# EAGLE schematic rx (EAGLE 9.6.0)
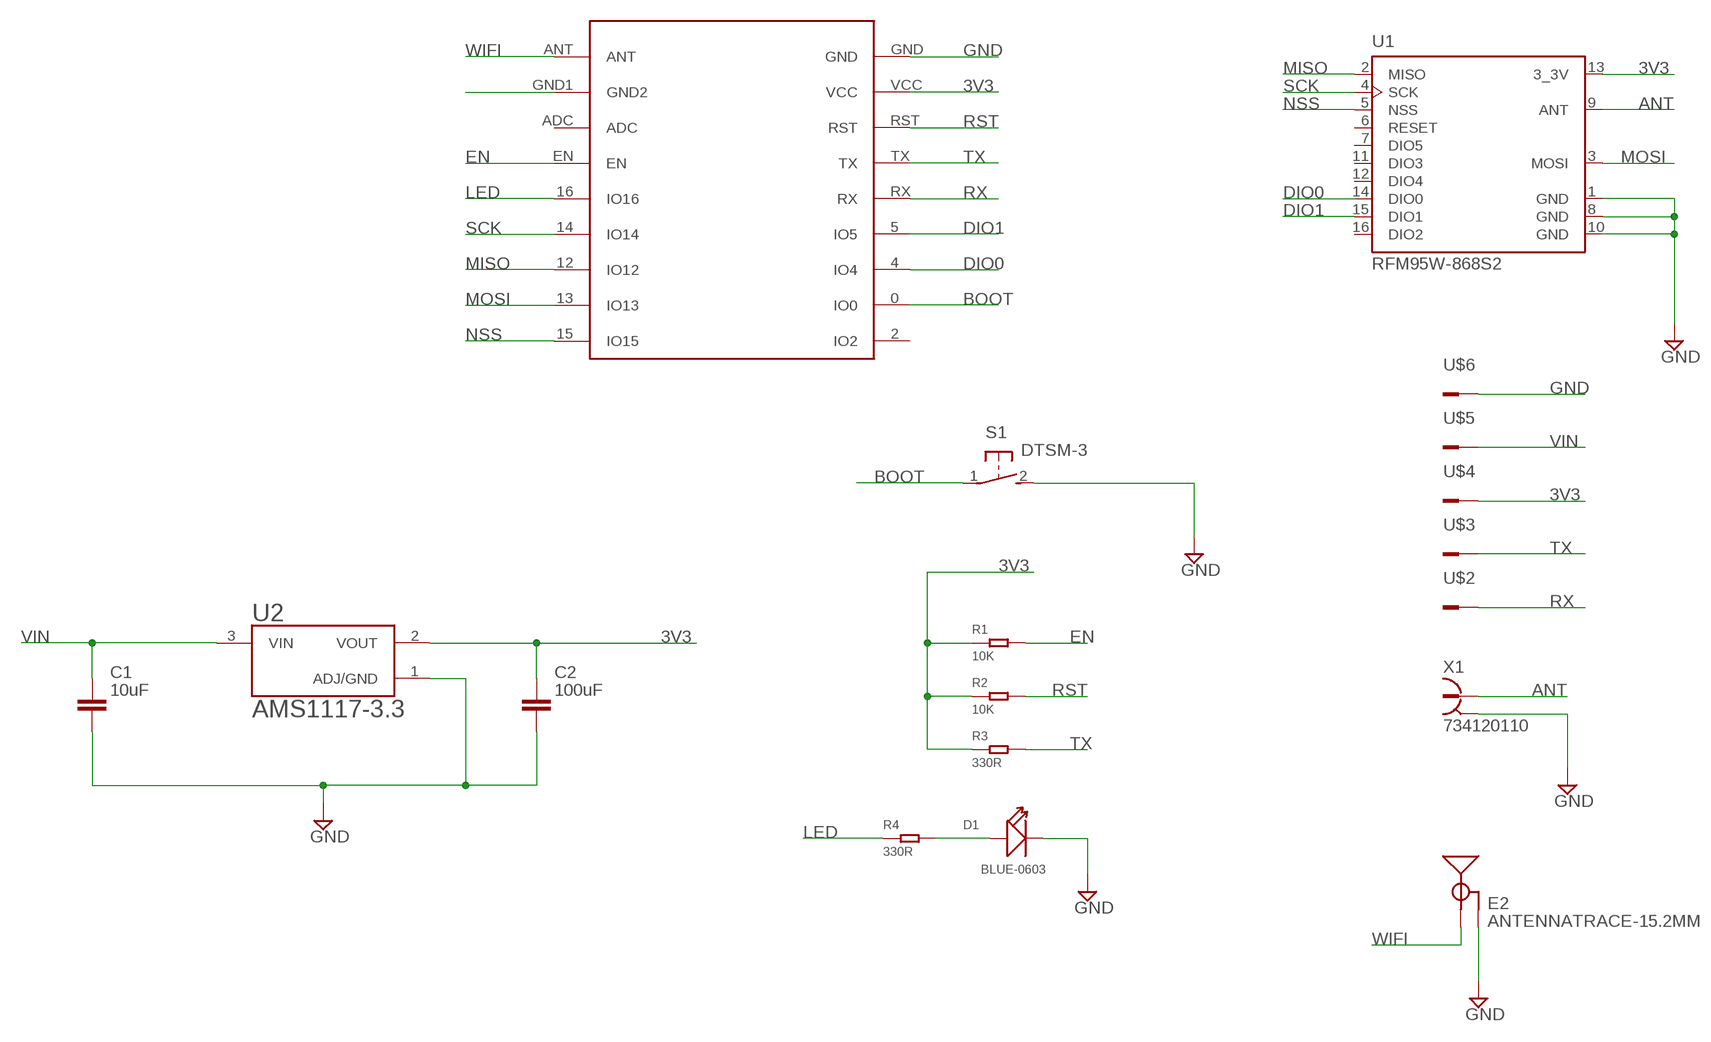
[diagram p0: schematic, sheet 1]

## Parts
C1  10uF  C_TANTALUM-1411(3528-METRIC)  [CAPM3528X210]
C2  100uF  C_TANTALUM-1411(3528-METRIC)  [CAPM3528X210]
D1  BLUE-0603  SMD-LED-CLEAR-BLUE(0603)  [LED-0603]
E2  ANTENNATRACE-15.2MM  [TRACE_ANTENNA_2.4GHZ_15.2MM]
R1  10K  SMD-RES-10K-1%-1/8W(0805)  [R0805]
R2  10K  SMD-RES-10K-1%-1/8W(0805)  [R0805]
R3  330R  SMD-RES-330R-5%-1/8W(0805)  [R0805]
R4  330R  SMD-RES-330R-5%-1/8W(0805)  [R0805]
S1  DTSM-3  [DTSM-3]
U1  RFM95W-868S2  [XCVR_RFM95W-868S2]
U2  AMS1117-3.3  [SOT229P700X180-4N]
U$1  ESP-M2  [ESP-M2]
U$2  CONN-1  [PAD1]
U$3  CONN-1  [PAD1]
U$4  CONN-1  [PAD1]
U$5  CONN-1  [PAD1]
U$6  CONN-1  [PAD1]
X1  734120110  [734120110]

## Nets
3V3: C2.1 R1.1 R2.1 R3.1 U1.13(3_3V) U2.2(VOUT) U$1.VCC U$4.P$1
ANT: U1.9(ANT) X1.1
BOOT: S1.1 U$1.0(IO0)
DIO0: U1.14(DIO0) U$1.4(IO4)
DIO1: U1.15(DIO1) U$1.5(IO5)
EN: R1.2 U$1.EN
GND: C1.2 C2.2 D1.- E2.GND S1.2 U1.1(GND) U1.8(GND) U1.10(GND) U2.1(ADJ/GND) U$1.GND U$1.GND1(GND2) U$6.P$1 X1.S@1 X1.S@2 X1.S@3
LED: R4.1 U$1.16(IO16)
MISO: U1.2(MISO) U$1.12(IO12)
MOSI: U1.3(MOSI) U$1.13(IO13)
N$1: D1.+ R4.2
NSS: U1.5(NSS) U$1.15(IO15)
RST: R2.2 U$1.RST
RX: U$1.RX U$2.P$1
SCK: U1.4(SCK) U$1.14(IO14)
TX: R3.2 U$1.TX U$3.P$1
VIN: C1.1 U2.3(VIN) U$5.P$1
WIFI: E2.ANT(SIGNAL) U$1.ANT
Unconnected: U1.6(RESET) U1.7(DIO5) U1.11(DIO3) U1.12(DIO4) U1.16(DIO2) U$1.2(IO2) U$1.ADC

## Library data of the parts
C1 C2 = Capacitor:C: Capacitor - Generic; CATEGORY: Capacitor
D1 = OPL_Optoelectronics:SMD-LED-CLEAR-BLUE(0603): 304090045; MPN: 19-217-BHC-ZL1M2RY-3T
E2 = esp-ant:ANTENNA: Chip antenna Chip antenna with ground or secondary connection. Common with larger metal RF connectors.
R1 R2 = OPL_Resistor:SMD-RES-10K-1%-1/8W(0805): 301012152; MPN: RC0805FR-0710KL
R3 R4 = OPL_Resistor:SMD-RES-330R-5%-1/8W(0805): 301012196; MPN: RC0805JR-071KL; VALUE: 1K
S1 = switch-tact:DTSM-3
U1 = RFM95:RFM95W-868S2: Mod Txrx Lora +20dbm 868mhz Smd; AVAILABILITY: Unavailable; DESCRIPTION: General ISM < 1GHz LoRa™ Transceiver Module 868MHz Antenna Not Included Surface Mount; MF: RF; MP: RFM95W-868S2; PACKAGE: SMD-16 Hope Microelectronics; PRICE: None
U2 = AMS1117-3.3:AMS1117-3.3: Sot223/Pkg 1-Amp 3.3-Volt Low Drop Out Voltage Regulatator; AVAILABILITY: Unavailable; DESCRIPTION: Sot223/Pkg 1-Amp 3.3-Volt Low Drop Out Voltage Regulatator; MF: Advanced Monolithic Systems; MP: AMS1117-3.3; PACKAGE: None; PRICE: None
U$1 = ESP-01F:ESP-M2: ESP8285 Module - M2; AVAILABILITY: Unavailable; DESCRIPTION: Wifi Module; MF: Doctors of Intelligence & Technology Co., LTD; MP: ESP-M2; PACKAGE: Package Analog Devices; PRICE: None
U$2-U$6 = wv-connector:CONN-1
X1 = u.fl:734120110: MICRO COAXIAL CONNECTOR RECEPTACLE VERTICAL Source: Data sheet <http://www.molex.com/pdm_docs/sd/734120110_sd.pdf>; AVAILABILITY: Unavailable; DESCRIPTION: U.FL _UMCC_ Connector Receptacle, Male Pin 50Ohm Surface Mount Solder; MF: Molex; MP: 734-12-0110; PACKAGE: None; PRICE: None